# EAGLE design hdmi_fpc_rev1 (EAGLE 7.2.0)
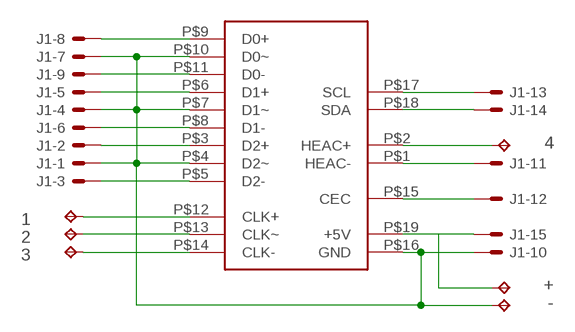
[diagram p0: schematic, sheet 1]

## Parts
1  TPPAD1-13  [P1-13]
2  TPPAD1-13  [P1-13]
3  TPPAD1-13  [P1-13]
4  TPPAD1-13  [P1-13]
+  TPPAD1-13  [P1-13]
-  TPPAD1-13  [P1-13]
J1  XF2L-1535-1  [XF2L-1535-1]
U$1  HDMI_MICRO  [MICRO_HDMI]

## Nets
GND: -.TP J1.1 J1.4 J1.7 J1.10 U$1.P$4(D2~) U$1.P$7(D1~) U$1.P$10(D0~) U$1.P$16(GND)
N$1: J1.6 U$1.P$8(D1-)
N$2: 1.TP U$1.P$12(CLK+)
N$3: J1.5 U$1.P$6(D1+)
N$4: J1.3 U$1.P$5(D2-)
N$5: J1.11 U$1.P$1(HEAC-)
N$6: J1.2 U$1.P$3(D2+)
N$7: J1.8 U$1.P$9(D0+)
N$8: 2.TP U$1.P$13(CLK~)
N$9: J1.9 U$1.P$11(D0-)
N$10: J1.13 U$1.P$17(SCL)
N$11: J1.14 U$1.P$18(SDA)
N$12: +.TP J1.15 U$1.P$19(+5V)
N$13: J1.12 U$1.P$15(CEC)
N$14: 3.TP U$1.P$14(CLK-)
N$15: 4.TP U$1.P$2(HEAC+)

## Library data of the parts
1-4 + - = testpad:TP: Test pad
J1 = con-omron:XF2*-15?: OMRON FPC Connector Source : http://www.omron.com/ecb/products/pdf/fpc.pdf; MPN: XF2L-1535-1A; OC_FARNELL: unknown; OC_NEWARK: 05M1997
U$1 = custom:HDMI

## Board
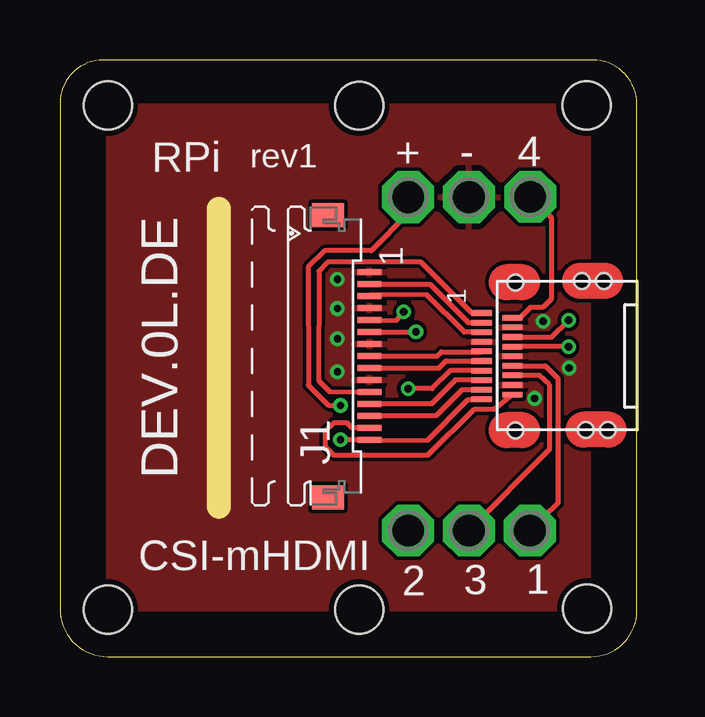
[diagram p1: board, top side]
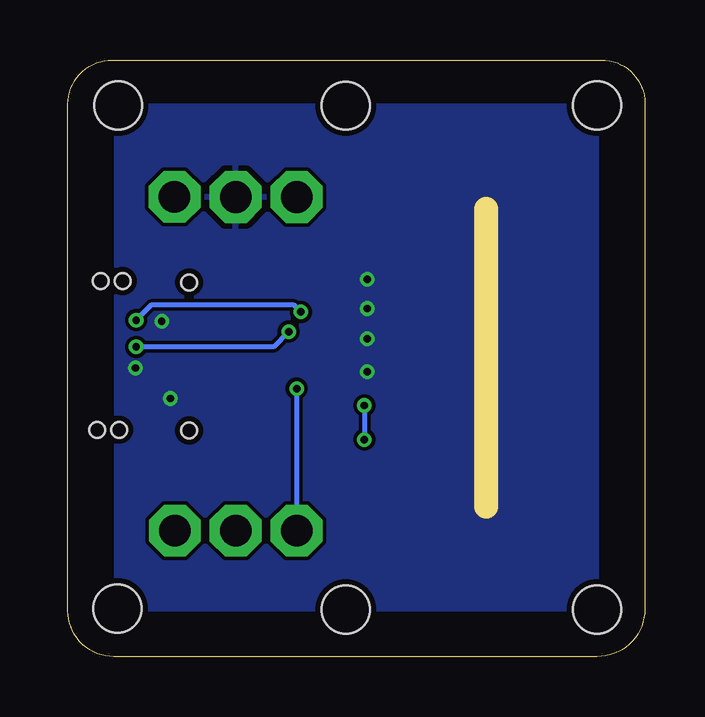
[diagram p2: board, bottom side, seen from below]

Size 24.05 x 24.88 mm. Coordinates in mm from the lower left corner, seen from the top.
Outline: 0,23.08 0,1.99 arc90 1.99,0 22.14,0 arc90 24.05,1.92 24.05,23.03 arc90 22.21,24.88 1.8,24.88 arc90 0,23.08
Copper layers (1*16): Top 0.035mm / dielectric 1.5mm / Bottom 0.035mm
Design rules "SeeedStudio_2layer_DRU_no_angle_20140221": minimum track width 6mil, minimum drill 12mil, track to track 6mil, track to pad 6mil, pad to pad 6mil, via to via 6mil, smd to smd 0mil, copper to edge 10mil, drill to drill 10mil, minimum pad ring 10mil, minimum via ring 6mil, stop-mask expansion 2mil, vias tented up to drill 100mil, thermal gap 10mil
Holes 2 mm at 21.96,22.99 1.99,22.99 21.98,2.01 1.99,1.97 12.47,1.97 12.47,22.97
Milling: 1 lines

### Footprints (pad centres in the part's own frame; a part is rotated, then mirrored left to right if it is on the bottom)
P1-13 = drill 1.321 pad 2.159 octagon: TP 0,0
XF2L-1535-1 = smd 1 x 0.25: 1 1.905,3.5; 2 1.905,3; 3 1.905,2.5; 4 1.905,2; 5 1.905,1.5; 6 1.905,1; 7 1.905,0.5; 8 1.905,0; 9 1.905,-0.5; 10 1.905,-1; 11 1.905,-1.5; 12 1.905,-2; 13 1.905,-2.5; 14 1.905,-3; 15 1.905,-3.5 | smd 1.34 x 1: M1 0.18,5.888; M2 0.18,-5.888
MICRO_HDMI = smd 0.23 x 0.85: P$1 1.795,6.47; P$2 1.595,5.19; P$3 1.395,6.47; P$4 1.195,5.19; P$5 0.995,6.47; P$6 0.795,5.19; P$7 0.595,6.47; P$8 0.395,5.19; P$9 0.195,6.47; P$10 -0.005,5.19; P$11 -0.205,6.47; P$12 -0.405,5.19; P$13 -0.605,6.47; P$14 -0.805,5.19; P$15 -1.005,6.47; P$16 -1.205,5.19; P$17 -1.405,6.47; P$18 -1.605,5.19; P$19 -1.805,6.47 | hole 0.65: -3.073,2.134; -3.073,1.219; 3.124,2.286; 3.124,1.372; -3.099,5.055; 3.073,5.055

### Placement (x,y rotation side)
1  19.6,5.26 0 top
2  14.52,5.26 0 top
3  17.06,5.26 0 top
4  19.61,19.18 0 top
+  14.52,19.16 0 top
-  17.06,19.16 0 top
J1  11,12.53 0 top
U$1  24.05,12.53 90 top

### Tracks (layer width: path | path; a pad name or v marks a point on that pad's centre or on a via)
GND  (via drill 0.3)
  Top 0.152: 12.91,14.54 J1.4
  other vias: 11.57,14.52 20.14,13.98 19.79,10.77 11.57,11.89 11.57,15.74 11.57,13.26 21.23,12.04
  pour Bottom: 1.99,22.96 22.05,22.97 22.05,2.01 1.99,1.99
  pour Top: 2.01,1.99 22.05,2.01 22.05,22.97 2.01,22.96
N$1  (via drill 0.3)
  Top 0.203: J1.6 14.84,13.54 v14.85,13.55 | v21.21,12.92 21.2,12.93 U$1.P$8
  Bottom 0.203: v14.85,13.55 15.48,12.92 v21.21,12.92
N$2
  Top 0.203: 1.TP 20.77,6.4 20.77,11.6 20.23,12.13 U$1.P$12
N$3  (via drill 0.3)
  Top 0.152: U$1.P$6 18.88,13.33 18.95,13.32
  Top 0.203: J1.5 14.04,14.02 v14.34,14.38 | 18.95,13.32 20.5,13.32 v21.21,14.03
  Bottom 0.203: v14.34,14.38 14.62,14.66 20.59,14.66 v21.21,14.03
N$4
  Top 0.203: U$1.P$5 16.86,13.53 15.29,15.1 12.91,15.07 J1.3
N$5
  Top 0.203: U$1.P$1 17.18,14.33 15.05,16.45 11.16,16.45 10.79,16.08 10.78,11.52 11.24,11.05 12.88,11.04 J1.11
N$6
  Top 0.203: J1.2 15.43,15.54 17.03,13.93 U$1.P$3
N$7
  Top 0.203: J1.8 15.72,12.54 15.9,12.71 17.57,12.71 U$1.P$9
N$8  (via drill 0.3)
  Top 0.203: U$1.P$13 16.29,11.93 15.52,11.18 v14.52,11.18
  Bottom 0.203: v14.52,11.18 2.TP
N$9
  Top 0.203: J1.9 15.81,12.04 16.1,12.33 U$1.P$11
N$10
  Top 0.203: U$1.P$17 16.77,11.13 15.68,10.05 12.91,10.05
  Top 0.254: 12.91,10.05 J1.13
N$11
  Top 0.203: J1.14 12.18,9.54 11.96,9.75 11.42,9.75 11.06,9.4 11.06,8.76 11.4,8.42 15.34,8.41 17.29,10.32 18.12,10.32 U$1.P$18
N$12  (via drill 0.3)
  Top 0.203: U$1.P$19 17.02,10.72 15.32,9.02 J1.15 12.88,9.05 v11.7,9.05 | +.TP 14.52,18.47 12.98,16.93 11.05,16.93 10.35,16.24 10.36,11.32 11.2,10.48 v11.7,10.48
  Bottom 0.203: v11.7,10.48 v11.7,9.05
N$13
  Top 0.203: U$1.P$15 16.48,11.54 15.49,10.54 13.18,10.54
  Top 0.254: 13.18,10.54 J1.12
N$14
  Top 0.203: 3.TP 20.4,8.64 20.4,11.34 20,11.73 U$1.P$14
N$15
  Top 0.203: 4.TP 20.48,18.3 20.48,14.92 20.13,14.57 19.62,14.57 19.18,14.13 U$1.P$2

### Text on the board
tPlace: RPi | rev1 | 1 | DEV.0L.DE | CSI-mHDMI